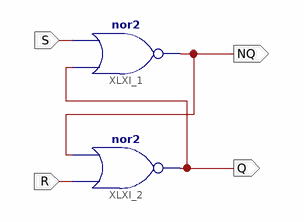
[diagram p0: schematic sheet 1]
// Xilinx ISE schematic latch_RS_NOR.sch (artix7) as structural Verilog: 2 symbols, 4 ports
module latch_RS_NOR (
  input  S,
  input  R,
  output NQ,
  output Q
);

  nor XLXI_1 (NQ, Q, S);
  nor XLXI_2 (Q, R, NQ);
endmodule
